# EAGLE design CarPower (EAGLE 6.4)
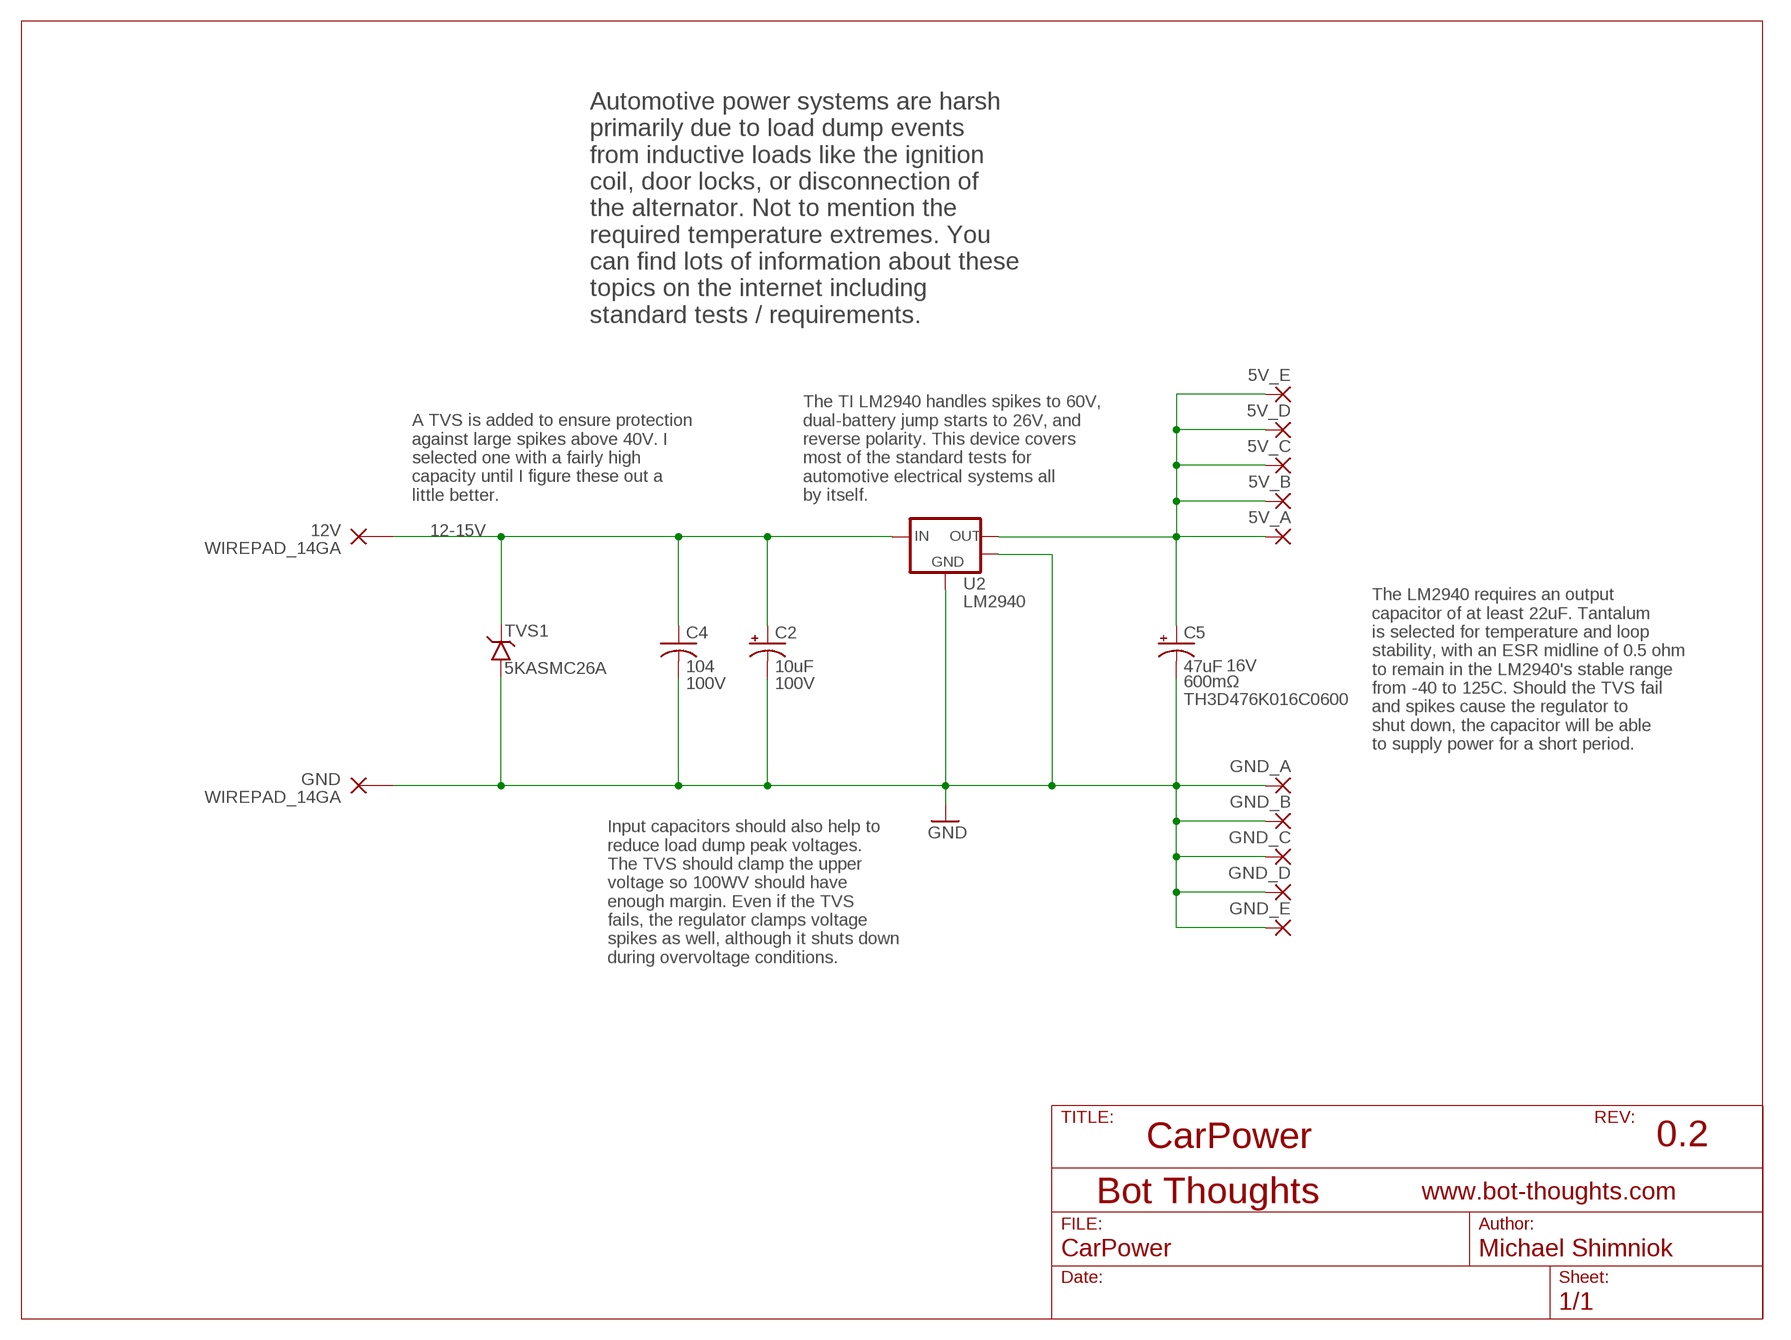
[diagram p0: schematic, sheet 1]

## Parts
5V_A  1,6/0,9  [1,6/0,9]
5V_B  1,6/0,9  [1,6/0,9]
5V_C  1,6/0,9  [1,6/0,9]
5V_D  1,6/0,9  [1,6/0,9]
5V_E  1,6/0,9  [1,6/0,9]
12V  WIREPAD_14GA  [PAD_14GA]
C2  10uF  CPOL-USE3.5-8  [E3,5-8]
C4  104  C-US025-024X044  [C025-024X044]
C5  47uF  CPOL-USSMCC  [SMC_C]
GND  WIREPAD_14GA  [PAD_14GA]
GND_A  1,6/0,9  [1,6/0,9]
GND_B  1,6/0,9  [1,6/0,9]
GND_C  1,6/0,9  [1,6/0,9]
GND_D  1,6/0,9  [1,6/0,9]
GND_E  1,6/0,9  [1,6/0,9]
TVS1  5KASMC26A  5KASMC  [DO-214AB]
U2  LM2940  LM2940KTT  [TO263-3]

## Nets
5V: 5V_A.1(P) 5V_B.1(P) 5V_C.1(P) 5V_D.1(P) 5V_E.1(P) C5.+ U2.3(VOUT)
12-15V: 12V.P$1(P) C2.+ C4.1 TVS1.C U2.1(VIN)
GND: C2.- C4.2 C5.- GND.P$1(P) GND_A.1(P) GND_B.1(P) GND_C.1(P) GND_D.1(P) GND_E.1(P) TVS1.A U2.2(GND) U2.4(TAB)

## Notes on the sheet
- Automotive power systems are harsh
  primarily due to load dump events
  from inductive loads like the ignition
  coil, door locks, or disconnection of
  the alternator. Not to mention the
  required temperature extremes. You
  can find lots of information about these
  topics on the internet including
  standard tests / requirements.
- A TVS is added to ensure protection
  against large spikes above 40V. I
  selected one with a fairly high
  capacity until I figure these out a
  little better.
- The TI LM2940 handles spikes to 60V,
  dual-battery jump starts to 26V, and
  reverse polarity. This device covers
  most of the standard tests for
  automotive electrical systems all
  by itself.
- The LM2940 requires an output
  capacitor of at least 22uF. Tantalum
  is selected for temperature and loop
  stability, with an ESR midline of 0.5 ohm
  to remain in the LM2940's stable range
  from -40 to 125C. Should the TVS fail
  and spikes cause the regulator to
  shut down, the capacitor will be able
  to supply power for a short period.
- Input capacitors should also help to
  reduce load dump peak voltages.
  The TVS should clamp the upper
  voltage so 100WV should have 
  enough margin. Even if the TVS
  fails, the regulator clamps voltage
  spikes as well, although it shuts down
  during overvoltage conditions.
- CarPower | 0.2

## Library data of the parts
5V_A 5V_B 5V_C 5V_D 5V_E GND_A GND_B GND_C GND_D GND_E = wirepad:1,6/0,9: THROUGH-HOLE PAD
12V GND = bt_electromech:WIREPAD: PIN PAD (PINPAD) Generic pin pad connector
C2 = rcl:CPOL-US: POLARIZED CAPACITOR, American symbol; VOLTAGE: 100V
C4 = rcl:C-US: CAPACITOR, American symbol; VOLTAGE: 100V
C5 = rcl:CPOL-US: POLARIZED CAPACITOR, American symbol; ESR: 600mΩ; PARTNO: TH3D476K016C0600; VOLTAGE: 16V
TVS1 = bt_diode:5KASMC: 5KASMC TVS Diode Surface mount PAR® Transient Voltage Suppressors with high temperature stability and high reliability conditions. Junction passivation optimized design passivated anisotropic rectifier technology. TJ = 185 °C capability suitable for high reliability and automotive requirement. AEC-Q101 qualified. PPPM=5000W Vishay General Semiconductor datasheet.pdf <http://www.vishay.com/docs/89432/5kasmc.pdf>
U2 = bt_regulator:LM2940: LM2940 LDO Voltage Regulator The LM2940-N/LM2940C positive voltage regulator features the ability to source 1A of output current with a dropout voltage of typically 0.5V and a maximum of 1V over the entire temperature range. Furthermore, a quiescent current reduction circuit has been included which reduces the ground current when the differential between the input voltage and the output exceeds approximately 3V. Designed also for vehicular applications, the LM2940-N/LM2940C and all regulated circuitry are protected from reverse battery installations or 2-battery jumps. During line transients, such as load dump when the input voltage can momentarily exceed the specified maximum operating voltage, the regulator will automatically shut down to protect both the internal circuits and the load. The LM2940/LM2940C cannot be harmed by temporary mirror-image insertion. Familiar regulator features such as short circuit and thermal overload protection are also provided. Datasheet.pdf <http://www.ti.com/lit/ds/symlink/lm2940-n.pdf>

## Board
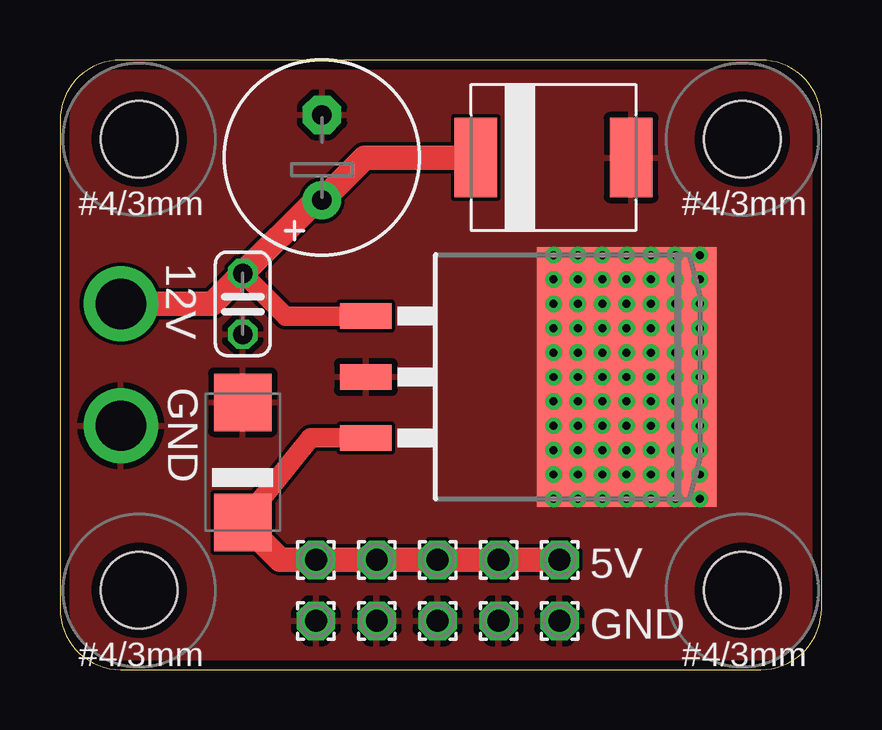
[diagram p1: board, top side]
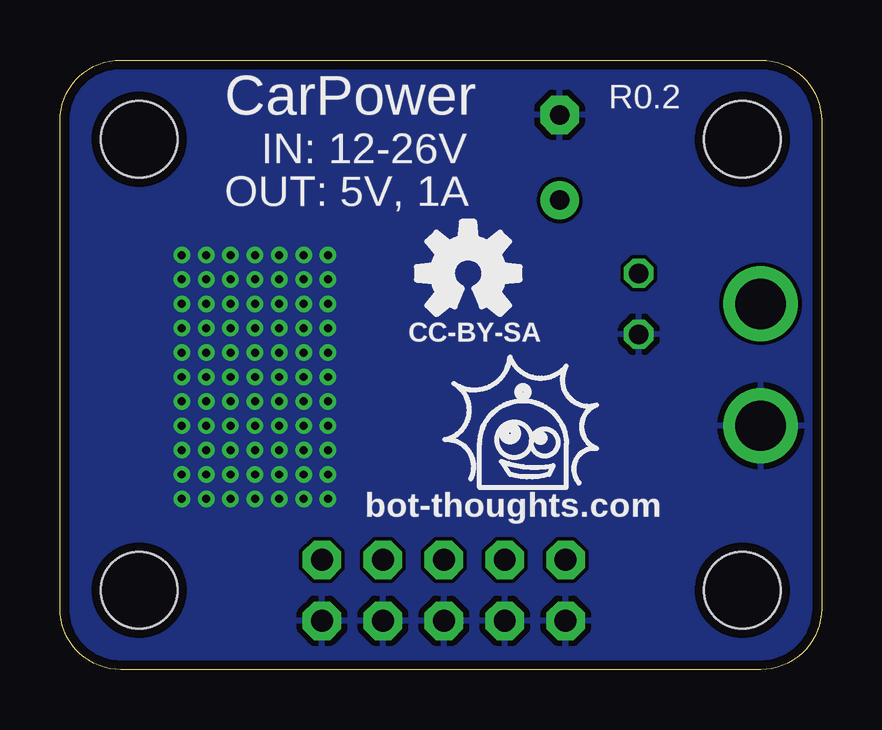
[diagram p2: board, bottom side, seen from below]

Size 31.75 x 25.4 mm. Coordinates in mm from the lower left corner, seen from the top.
Outline: 0,22.86 0,2.54 arc90 2.54,0 29.21,0 arc90 31.75,2.54 31.75,22.86 arc90 29.21,25.4 2.54,25.4 arc90 0,22.86
Copper layers (1*16): Top 0.0356mm / dielectric 1.5011mm / Bottom 0.0356mm
Design rules "LaenPCBOrder": minimum track width 6mil, minimum drill 13mil, track to track 6mil, track to pad 6mil, pad to pad 6mil, via to via 6mil, smd to smd 6mil, copper to edge 15mil, drill to drill 6mil, minimum pad ring 7mil, minimum via ring 7mil, stop-mask expansion 3mil, vias tented up to drill 20mil, thermal gap 10mil

### Footprints (pad centres in the part's own frame; a part is rotated, then mirrored left to right if it is on the bottom)
1,6/0,9 = drill 0.914 pad 1.6 octagon: 1 0,0
PAD_14GA = drill 2.1: P$1 0,0
E3,5-8 = drill 0.813 pad 1.6: + -1.778,0 | drill 0.813 pad 1.6 octagon: - 1.778,0
C025-024X044 = drill 0.813 octagon: 1 -1.27,0; 2 1.27,0
SMC_C = smd 2.4 x 2.4: + -2.5,0; - 2.5,0
DO-214AB = smd 1.778 x 3.302: A 3.239,0; C -3.239,0
TO263-3 = smd 1.067 x 2.159: 1 -2.54,-7.061; 2 0,-7.061; 3 2.54,-7.061 | smd 10.795 x 7.493: 4 0,3.81
MOUNT_HOLE_3MM = hole 3.2: 0,0

### Placement (x,y rotation side)
5V_A  10.67,4.57 0 top
5V_B  13.21,4.57 90 top
5V_C  15.75,4.57 90 top
5V_D  18.29,4.57 0 top
5V_E  20.83,4.57 0 top
12V  2.54,15.24 270 top
C2  10.92,21.34 90 top
C4  7.62,15.24 270 top
C5  7.62,8.64 90 top
GND  2.54,10.16 270 top
GND_A  10.67,2.03 90 top
GND_B  13.21,2.03 90 top
GND_C  15.75,2.03 90 top
GND_D  18.29,2.03 0 top
GND_E  20.83,2.03 0 top
TVS1  20.57,21.34 0 top
U2  19.81,12.19 270 top
U$1  [MOUNT_HOLE_3MM]  3.3,22.1 0 top
U$2  [MOUNT_HOLE_3MM]  28.45,22.1 0 top
U$3  [MOUNT_HOLE_3MM]  28.45,3.3 0 top
U$4  [MOUNT_HOLE_3MM]  3.3,3.3 0 top

### Tracks (layer width: path | path; a pad name or v marks a point on that pad's centre or on a via)
5V
  Top 0.813: U2.3 10.45,9.65 C5.+
  Top 1.016: C5.+ 9.18,4.57 5V_A.1 5V_B.1 5V_C.1 5V_D.1 5V_E.1
12-15V
  Top 0.813: U2.1 9.4,14.73 C4.1
  Top 1.016: 12V.P$1 6.35,15.24 C4.1 10.67,19.56 C2.+ 12.7,21.34 TVS1.C
GND  (via drill 0.33)
  other vias: 26.67,16.26 26.67,15.24 26.67,14.22 26.67,13.21 26.67,12.19 26.67,11.18 26.67,10.16 26.67,9.14 26.67,8.13 25.65,16.26 25.65,15.24 25.65,14.22 25.65,13.21 25.65,12.19 25.65,11.18 25.65,10.16 25.65,9.14 25.65,8.13 24.64,16.26 24.64,15.24 24.64,14.22 24.64,13.21 24.64,12.19 24.64,11.18 24.64,10.16 24.64,9.14 24.64,8.13 23.62,16.26 23.62,15.24 23.62,14.22 23.62,13.21 23.62,12.19 23.62,11.18 23.62,10.16 23.62,9.14 23.62,8.13 22.61,16.26 22.61,15.24 22.61,14.22 22.61,13.21 22.61,12.19 22.61,11.18 22.61,10.16 22.61,9.14 22.61,8.13 21.59,16.26 21.59,15.24 21.59,14.22 21.59,13.21 21.59,12.19 21.59,11.18 21.59,10.16 21.59,9.14 21.59,8.13 20.57,16.26 20.57,15.24 20.57,14.22 20.57,13.21 20.57,12.19 20.57,11.18 20.57,10.16 20.57,9.14 20.57,8.13 20.57,17.27 21.59,17.27 22.61,17.27 23.62,17.27 25.65,17.27 24.64,17.27 26.67,17.27 21.59,7.11 20.57,7.11 22.61,7.11 23.62,7.11 24.64,7.11 25.65,7.11 26.67,7.11
  pour Bottom (rank 2): 31.75,22.86 31.75,2.54 arc-90 29.21,0 2.54,0 arc-90 0,2.54 0,22.86 arc-90 2.54,25.4 29.21,25.4 arc-90
  pour Top (rank 2): 31.75,22.86 31.75,2.54 arc-90 29.21,0 2.54,0 arc-90 0,2.54 0,22.86 arc-90 2.54,25.4 29.21,25.4 arc-90
  pour Top (no thermals): 18.8,18.03 28.45,18.03 28.45,6.35 18.8,6.35

### Text on the board
bPlace: IN: 12-26V | OUT: 5V, 1A
tNames: 5V | GND
bNames: R0.2 | CarPower | CC-BY-SA | bot-thoughts.com
tsilk: AutoPower | 5V | 104 | 10uF | 12V | GND | 5KASMC26A | LM2940 | 47uF | WIREPAD_16GA | GND | 5V | 12-26V IN | R0.2 | 5V, 1A OUT
bsilk: bot-thoughts.com | CC-BY-SA